# Altium schematic sheet PL_Ethernet.SchDoc: PL_Ethernet
size A3; Author: Carlos Barreiro; Organization: Escuela Técnica Superior de Ingeniería de Sistemas Informáticos de la Universidad Politécnica de Madrid; Address1: Campus Sur de la Universidad Politécnica de Madrid; Address2: Calle de Alan Turing, s/nº; Address3: Madrid 28031; Address4: España; DocumentNumber: 15; SheetNumber: 15; SheetTotal: 16
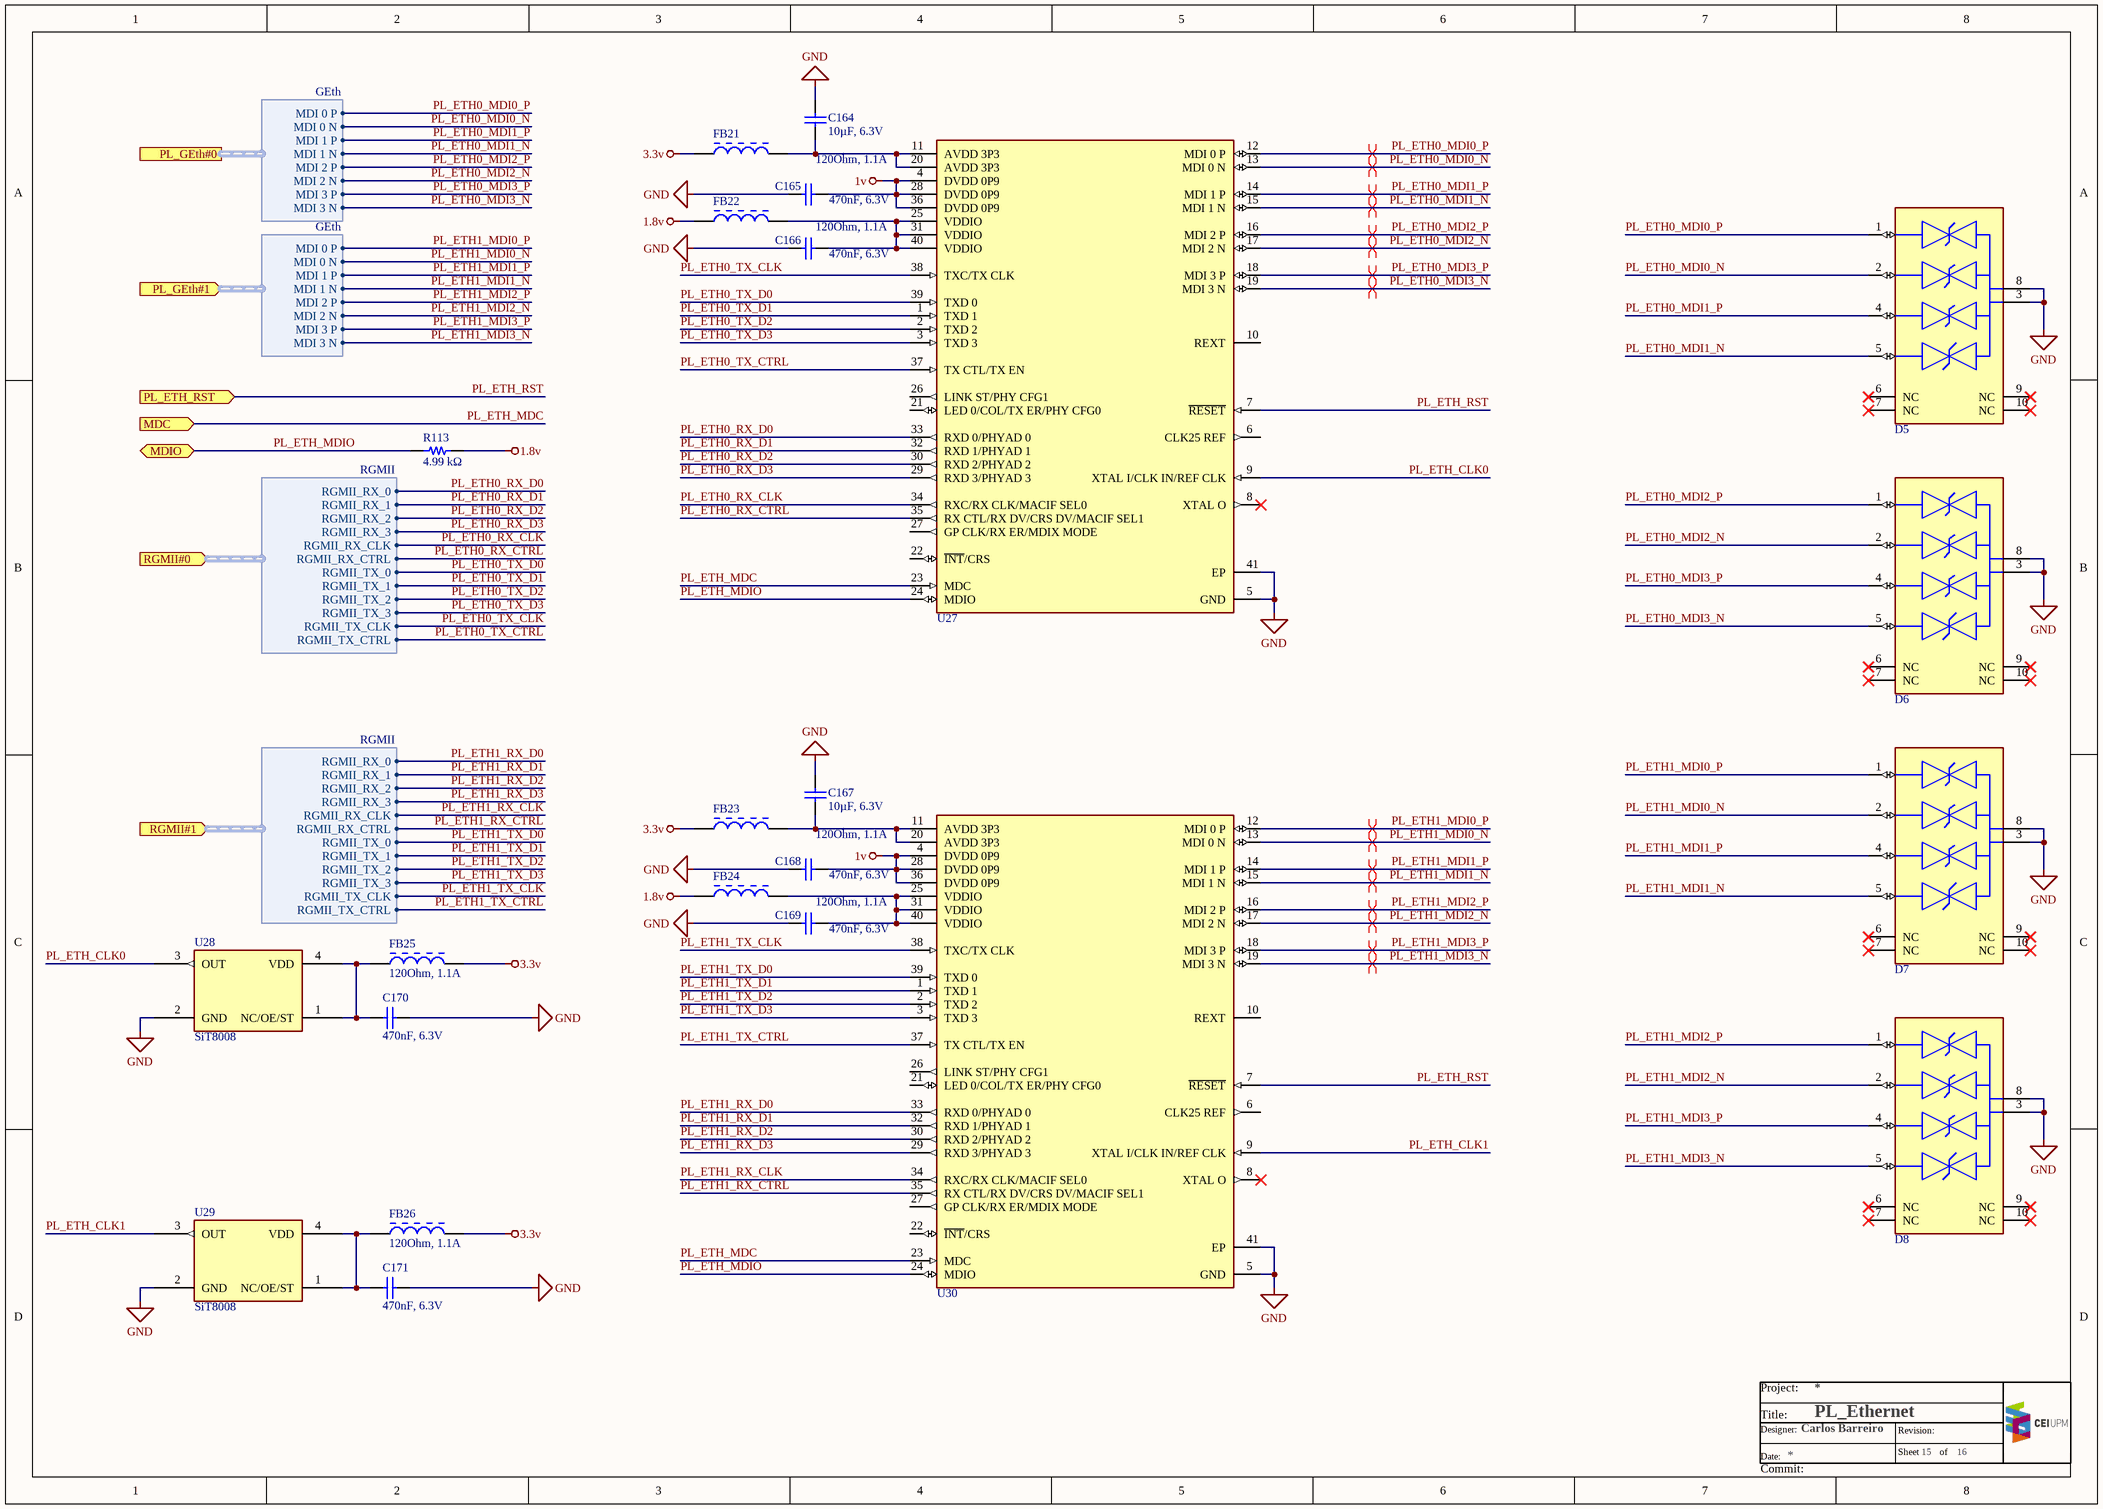
[diagram p0: PL_Ethernet.SchDoc]

## Parts
C164  10µF, 6.3V  [WURTH_WCAP-CSGP_0402]
C165  470nF, 6.3V  [WURTH_WCAP-CSGP_0402]
C166  470nF, 6.3V  [WURTH_WCAP-CSGP_0402]
C167  10µF, 6.3V  [WURTH_WCAP-CSGP_0402]
C168  470nF, 6.3V  [WURTH_WCAP-CSGP_0402]
C169  470nF, 6.3V  [WURTH_WCAP-CSGP_0402]
C170  470nF, 6.3V  [WURTH_WCAP-CSGP_0402]
C171  470nF, 6.3V  [WURTH_WCAP-CSGP_0402]
D5  ESD204DQAR  [TEXAS_USON10]  (value not drawn)
D6  ESD204DQAR  [TEXAS_USON10]  (value not drawn)
D7  ESD204DQAR  [TEXAS_USON10]  (value not drawn)
D8  ESD204DQAR  [TEXAS_USON10]  (value not drawn)
FB21  120Ohm, 1.1A  [WURTH-CBF_0402]
FB22  120Ohm, 1.1A  [WURTH-CBF_0402]
FB23  120Ohm, 1.1A  [WURTH-CBF_0402]
FB24  120Ohm, 1.1A  [WURTH-CBF_0402]
FB25  120Ohm, 1.1A  [WURTH-CBF_0402]
FB26  120Ohm, 1.1A  [WURTH-CBF_0402]
R113  4.99 kΩ  [PANASONIC_ERJ2G_0402]
U27  ADIN1300CCPZ  [ADI_LFCSP40]  (value not drawn)
U28  SiT8008  [SiTime_5032_4]
U29  SiT8008  [SiTime_5032_4]
U30  ADIN1300CCPZ  [ADI_LFCSP40]  (value not drawn)

## Ports
MDC (in), MDIO (bidir), PL_ETH_RST (in), PL_GEth#0 (harness GEth), PL_GEth#1 (in, harness GEth), RGMII#0 (in, harness RGMII), RGMII#1 (in, harness RGMII)

## Harnesses
GEth: MDI 0 P, MDI 0 N, MDI 1 P, MDI 1 N, MDI 2 P, MDI 2 N, MDI 3 P, MDI 3 N
RGMII: RGMII_RX_0, RGMII_RX_1, RGMII_RX_2, RGMII_RX_3, RGMII_RX_CLK, RGMII_RX_CTRL, RGMII_TX_0, RGMII_TX_1, RGMII_TX_2, RGMII_TX_3, RGMII_TX_CLK, RGMII_TX_CTRL

## Nets
1.8v: FB22.1 FB24.1 R113.2
1v: C165.2 C168.2 U27.4(DVDD_0P9) U27.28(DVDD_0P9) U27.36(DVDD_0P9) U30.4(DVDD_0P9) U30.28(DVDD_0P9) U30.36(DVDD_0P9)
3.3v: FB21.1 FB23.1 FB25.2 FB26.2
GND: C164.2 C165.1 C166.1 C167.2 C168.1 C169.1 C170.1 C171.1 D5.3(GND) D5.8(GND) D6.3(GND) D6.8(GND) D7.3(GND) D7.8(GND) D8.3(GND) D8.8(GND) U27.5(GND) U27.41(EP) U28.2(GND) U29.2(GND) U30.5(GND) U30.41(EP)
PL_ETH0_MDI0_N: D5.2(IO2) U27.13(MDI_0_N) ; port PL_GEth#0.MDI 0 N
PL_ETH0_MDI0_P: D5.1(IO1) U27.12(MDI_0_P) ; port PL_GEth#0.MDI 0 P
PL_ETH0_MDI1_N: D5.5(IO4) U27.15(MDI_1_N) ; port PL_GEth#0.MDI 1 N
PL_ETH0_MDI1_P: D5.4(IO3) U27.14(MDI_1_P) ; port PL_GEth#0.MDI 1 P
PL_ETH0_MDI2_N: D6.2(IO2) U27.17(MDI_2_N) ; port PL_GEth#0.MDI 2 N
PL_ETH0_MDI2_P: D6.1(IO1) U27.16(MDI_2_P) ; port PL_GEth#0.MDI 2 P
PL_ETH0_MDI3_N: D6.5(IO4) U27.19(MDI_3_N) ; port PL_GEth#0.MDI 3 N
PL_ETH0_MDI3_P: D6.4(IO3) U27.18(MDI_3_P) ; port PL_GEth#0.MDI 3 P
PL_ETH0_RX_CLK: U27.34(RXC/RX_CLK/MACIF_SEL0) ; port RGMII#0.RGMII_RX_CLK
PL_ETH0_RX_CTRL: U27.35(RX_CTL/RX_DV/CRS_DV/MACIF_SEL1) ; port RGMII#0.RGMII_RX_CTRL
PL_ETH0_RX_D0: U27.33(RXD_0/PHYAD_0) ; port RGMII#0.RGMII_RX_0
PL_ETH0_RX_D1: U27.32(RXD_1/PHYAD_1) ; port RGMII#0.RGMII_RX_1
PL_ETH0_RX_D2: U27.30(RXD_2/PHYAD_2) ; port RGMII#0.RGMII_RX_2
PL_ETH0_RX_D3: U27.29(RXD_3/PHYAD_3) ; port RGMII#0.RGMII_RX_3
PL_ETH0_TX_CLK: U27.38(TXC/TX_CLK) ; port RGMII#0.RGMII_TX_CLK
PL_ETH0_TX_CTRL: U27.37(TX_CTL/TX_EN) ; port RGMII#0.RGMII_TX_CTRL
PL_ETH0_TX_D0: U27.39(TXD_0) ; port RGMII#0.RGMII_TX_0
PL_ETH0_TX_D1: U27.1(TXD_1) ; port RGMII#0.RGMII_TX_1
PL_ETH0_TX_D2: U27.2(TXD_2) ; port RGMII#0.RGMII_TX_2
PL_ETH0_TX_D3: U27.3(TXD_3) ; port RGMII#0.RGMII_TX_3
PL_ETH1_MDI0_N: D7.2(IO2) U30.13(MDI_0_N) ; port PL_GEth#1.MDI 0 N
PL_ETH1_MDI0_P: D7.1(IO1) U30.12(MDI_0_P) ; port PL_GEth#1.MDI 0 P
PL_ETH1_MDI1_N: D7.5(IO4) U30.15(MDI_1_N) ; port PL_GEth#1.MDI 1 N
PL_ETH1_MDI1_P: D7.4(IO3) U30.14(MDI_1_P) ; port PL_GEth#1.MDI 1 P
PL_ETH1_MDI2_N: D8.2(IO2) U30.17(MDI_2_N) ; port PL_GEth#1.MDI 2 N
PL_ETH1_MDI2_P: D8.1(IO1) U30.16(MDI_2_P) ; port PL_GEth#1.MDI 2 P
PL_ETH1_MDI3_N: D8.5(IO4) U30.19(MDI_3_N) ; port PL_GEth#1.MDI 3 N
PL_ETH1_MDI3_P: D8.4(IO3) U30.18(MDI_3_P) ; port PL_GEth#1.MDI 3 P
PL_ETH1_RX_CLK: U30.34(RXC/RX_CLK/MACIF_SEL0) ; port RGMII#1.RGMII_RX_CLK
PL_ETH1_RX_CTRL: U30.35(RX_CTL/RX_DV/CRS_DV/MACIF_SEL1) ; port RGMII#1.RGMII_RX_CTRL
PL_ETH1_RX_D0: U30.33(RXD_0/PHYAD_0) ; port RGMII#1.RGMII_RX_0
PL_ETH1_RX_D1: U30.32(RXD_1/PHYAD_1) ; port RGMII#1.RGMII_RX_1
PL_ETH1_RX_D2: U30.30(RXD_2/PHYAD_2) ; port RGMII#1.RGMII_RX_2
PL_ETH1_RX_D3: U30.29(RXD_3/PHYAD_3) ; port RGMII#1.RGMII_RX_3
PL_ETH1_TX_CLK: U30.38(TXC/TX_CLK) ; port RGMII#1.RGMII_TX_CLK
PL_ETH1_TX_CTRL: U30.37(TX_CTL/TX_EN) ; port RGMII#1.RGMII_TX_CTRL
PL_ETH1_TX_D0: U30.39(TXD_0) ; port RGMII#1.RGMII_TX_0
PL_ETH1_TX_D1: U30.1(TXD_1) ; port RGMII#1.RGMII_TX_1
PL_ETH1_TX_D2: U30.2(TXD_2) ; port RGMII#1.RGMII_TX_2
PL_ETH1_TX_D3: U30.3(TXD_3) ; port RGMII#1.RGMII_TX_3
PL_ETH_CLK0: U27.9(XTAL_I/CLK_IN/REF_CLK) U28.3(OUT)
PL_ETH_CLK1: U29.3(OUT) U30.9(XTAL_I/CLK_IN/REF_CLK)
PL_ETH_MDC: U27.23(MDC) U30.23(MDC) ; port MDC
PL_ETH_MDIO: R113.1 U27.24(MDIO) U30.24(MDIO) ; port MDIO
PL_ETH_RST: U27.7(~{RESET}) U30.7(~{RESET}) ; port PL_ETH_RST
NetC164_1: C164.1 FB21.2 U27.11(AVDD_3P3) U27.20(AVDD_3P3)
NetC166_2: C166.2 FB22.2 U27.25(VDDIO) U27.31(VDDIO) U27.40(VDDIO)
NetC167_1: C167.1 FB23.2 U30.11(AVDD_3P3) U30.20(AVDD_3P3)
NetC169_2: C169.2 FB24.2 U30.25(VDDIO) U30.31(VDDIO) U30.40(VDDIO)
NetC170_2: C170.2 FB25.1 U28.1(NC/OE/ST) U28.4(VDD)
NetC171_2: C171.2 FB26.1 U29.1(NC/OE/ST) U29.4(VDD)

Not connected (* = marked no-connect by the designer): D5 6(NC)* 7(NC)* 9(NC)* 10(NC)*; D6 6(NC)* 7(NC)* 9(NC)* 10(NC)*; D7 6(NC)* 7(NC)* 9(NC)* 10(NC)*; D8 6(NC)* 7(NC)* 9(NC)* 10(NC)*; U27 6(CLK25_REF) 8(XTAL_O)* 10(REXT) 21(LED_0/COL/TX_ER/PHY_CFG0) 22(~{INT}/CRS) 26(LINK_ST/PHY_CFG1) 27(GP_CLK/RX_ER/MDIX_MODE); U30 6(CLK25_REF) 8(XTAL_O)* 10(REXT) 21(LED_0/COL/TX_ER/PHY_CFG0) 22(~{INT}/CRS) 26(LINK_ST/PHY_CFG1) 27(GP_CLK/RX_ER/MDIX_MODE)

## Layout directives
differential pair: PL_ETH0_MDI0_N, PL_ETH0_MDI0_P, PL_ETH0_MDI1_N, PL_ETH0_MDI1_P, PL_ETH0_MDI2_N, PL_ETH0_MDI2_P, PL_ETH0_MDI3_N, PL_ETH0_MDI3_P, PL_ETH1_MDI0_N, PL_ETH1_MDI0_P, PL_ETH1_MDI1_N, PL_ETH1_MDI1_P, PL_ETH1_MDI2_N, PL_ETH1_MDI2_P, PL_ETH1_MDI3_N, PL_ETH1_MDI3_P

## Notes on the sheet
- Project:
- Title:
- Date:
- Designer:
- Sheet
- Revision:
- of
- Commit:

## Library data of the parts
C164 C167 = 885012105020: WCAP-CSGP Multilayer Ceramic Chip Capacitor, General Purpose, size 0402, X5R, 10uF, 6.3V; Manufacturer: Wurth Elektronik; Rated Voltage: 6.3VDC; Isolation Resistance  min.: 0.01GOhm; Capacitance Tolerance: +/20%; Dissipation Factor max.: 10%; Technical Reference: X5R0402106M6R3DFCT10000; ComponentLink1Description: Manufacturer; ComponentLink1URL: http://www.we-online.de; ComponentLink2Description: Datasheet; ComponentLink2URL: https://www.we-online.com/catalog/datasheet/885012105020.pdf; Operating Temperature: -55 to +85degC; Packaging: Tape and Reel; Manufacturer Part Number: 885012105020; Published Date: April 2021; Ceramic Type: X5R; Height: 0.5mm; Mounting Technology: SMT; Size: 0402; Capacitance: 10uF; Q-Factor min.: -
C165 C166 C168-C171 = 885012105004: WCAP-CSGP Multilayer Ceramic Chip Capacitor, General Purpose, size 0402, X5R, 470nF, 6.3V; Manufacturer: Wurth Elektronik; Rated Voltage: 6.3VDC; Isolation Resistance  min.: 0.2GOhm; Capacitance Tolerance: +/-20%; Dissipation Factor max.: 10%; Technical Reference: X5R0402474M6R3DFCT10000; ComponentLink1Description: Manufacturer; ComponentLink1URL: http://www.we-online.de; ComponentLink2Description: Datasheet; ComponentLink2URL: https://www.we-online.com/catalog/datasheet/885012105004.pdf; Operating Temperature: -55 to +85degC; Packaging: Tape and Reel; Manufacturer Part Number: 885012105004; Published Date: April 2021; Ceramic Type: X5R; Height: 0.5mm; Mounting Technology: SMT; Size: 0402; Capacitance: 470nF; Supplier 1: Digi-Key; Supplier 2: Mouser; Supplier Part Number 1: 732-7481-1-ND; Supplier Part Number 2: 710-885012105004
D5-D8 = ESD204DQAR: ESD204 4-Channel Low-Capacitance Surge and ESD Protection Diode; Number of channels (#): 4; IO capacitance (Typ) (pF): 0.55; Vrwm (V): 3.6; Bi-/uni-directional: Bi-Directional; IO leakage current (Max) (nA): 10; Rating: Catalog; Dynamic resistance (Typ) (Ω): 0.3; Clamping voltage (V): 11.5; Operating temperature range (C): -40ºC to 125ºC; ComponentLink1Description: Manufacturer; ComponentLink1URL: https://www.ti.com/product/ESD204; Supplier 1: Digi-Key; Supplier 2: Mouser; Supplier Part Number 1: 296-49504-1-ND; Supplier Part Number 2: 595-ESD204DQAR
FB21-FB26 = 74279271: WE-CBF SMT EMI Suppression Ferrite Bead, size 0402, 120Ohm, 1.1A; Manufacturer: Wurth Elektronik; Impedance max.: 200Ohm; DC Resistance max.: 0.2Ohm; Type: Wide Band; ComponentLink1Description: Manufacturer; ComponentLink1URL: http://www.we-online.de; ComponentLink2Description: Datasheet; ComponentLink2URL: https://www.we-online.com/catalog/datasheet/74279271.pdf; Operating Temperature: -55 to +125degC; Packaging: Tape and Reel; Published Date: December 2021; Rated Current: 1.1A; Manufacturer Part Number: 74279271; Impedance @100MHz: 120Ohm; Mounting Technology: SMT; Size: 0402; Height: 0.5mm; Length: 1mm; Width: 0.5mm
R113 = ERJ2RKF4991X: General Purpose Thick Film Chip Resistors; Manufacturer: Panasonic; Power (0402): 0.1 W; Limiting Voltage (0402): 50; Maximum Voltage (0402): 100; Resistance Range (Ω): 1Ω to 100MΩ; AEC 200: Grade 0; Size (0402): 2GE; ComponentLink1Description: Catalog; ComponentLink1URL: https://industrial.panasonic.com/ww/products/pt/general-purpose-chip-resistors/models?op=search&model_status_current=1&page=0#model-list-search-results; Series: ERJ; Temperature Range (ºC): -55 to +155; Supplier 1: Digi-Key; Supplier Part Number 1: P4.99KLTR-ND
U27 U30 = ADIN1300CCPZ: Robust, Industrial, Low Latency and Low Power 10 Mbps, 100 Mbps, and 1 Gbps Ethernet PHY; MAC Interface: MII, RMII, RGMII; Package: 40-lead, 6 mm × 6 mm LFCSP; Operating Temperature: −40°C to +105°C; ComponentLink1Description: Manufacturer; ComponentLink1URL: https://www.analog.com/en/products/adin1300.html#product-tools; ComponentLink2Description: Application Note; ComponentLink2URL: https://wiki.analog.com/resources/eval/user-guides/adin1300-and-adin1200/cap-coupling#:~:text=The%20ADIN1300%20and%20ADIN1200%20are,10%2F100%20Mbps%20Ethernet%20speeds.; Supplier 1: Digi-Key; Supplier 2: Mouser; Supplier Part Number 2: 584-ADIN1300CCPZ; Supplier Part Number 1: 505-ADIN1300CCPZ-ND
U28 U29 = SiT8008: Programmable oscillator, featuring wide frequency range, low power consumption, small size and excellent stability.; Frequency: 1 to 110 MHz; Frequency Stability (ppm): ±20, ±25, ±50; Phase Jitter (rms): 1.3 ps; Output Type: LVCMOS; Voltage Supply (V): 1.8V to 3.3V; Package Type (mm²): 5.0x3.2; Operating Temperature Range (°C): -40ºC to +85ºC; ComponentLink1Description: Manufacturer; ComponentLink1URL: https://www.sitime.com/products/lvcmos-oscillators/sit8008; Supplier 1: Mouser; Supplier Part Number 1: 788-8008BI2333S1000G